# Altium project ControlBoard.PrjPCB (part 2 of 4)

## Sheet CTR_USB.SchDoc: USB
size A4; DrawnBy: Andrei Divinagracia; Revision: 0A; SheetNumber: 9; SheetTotal: 10
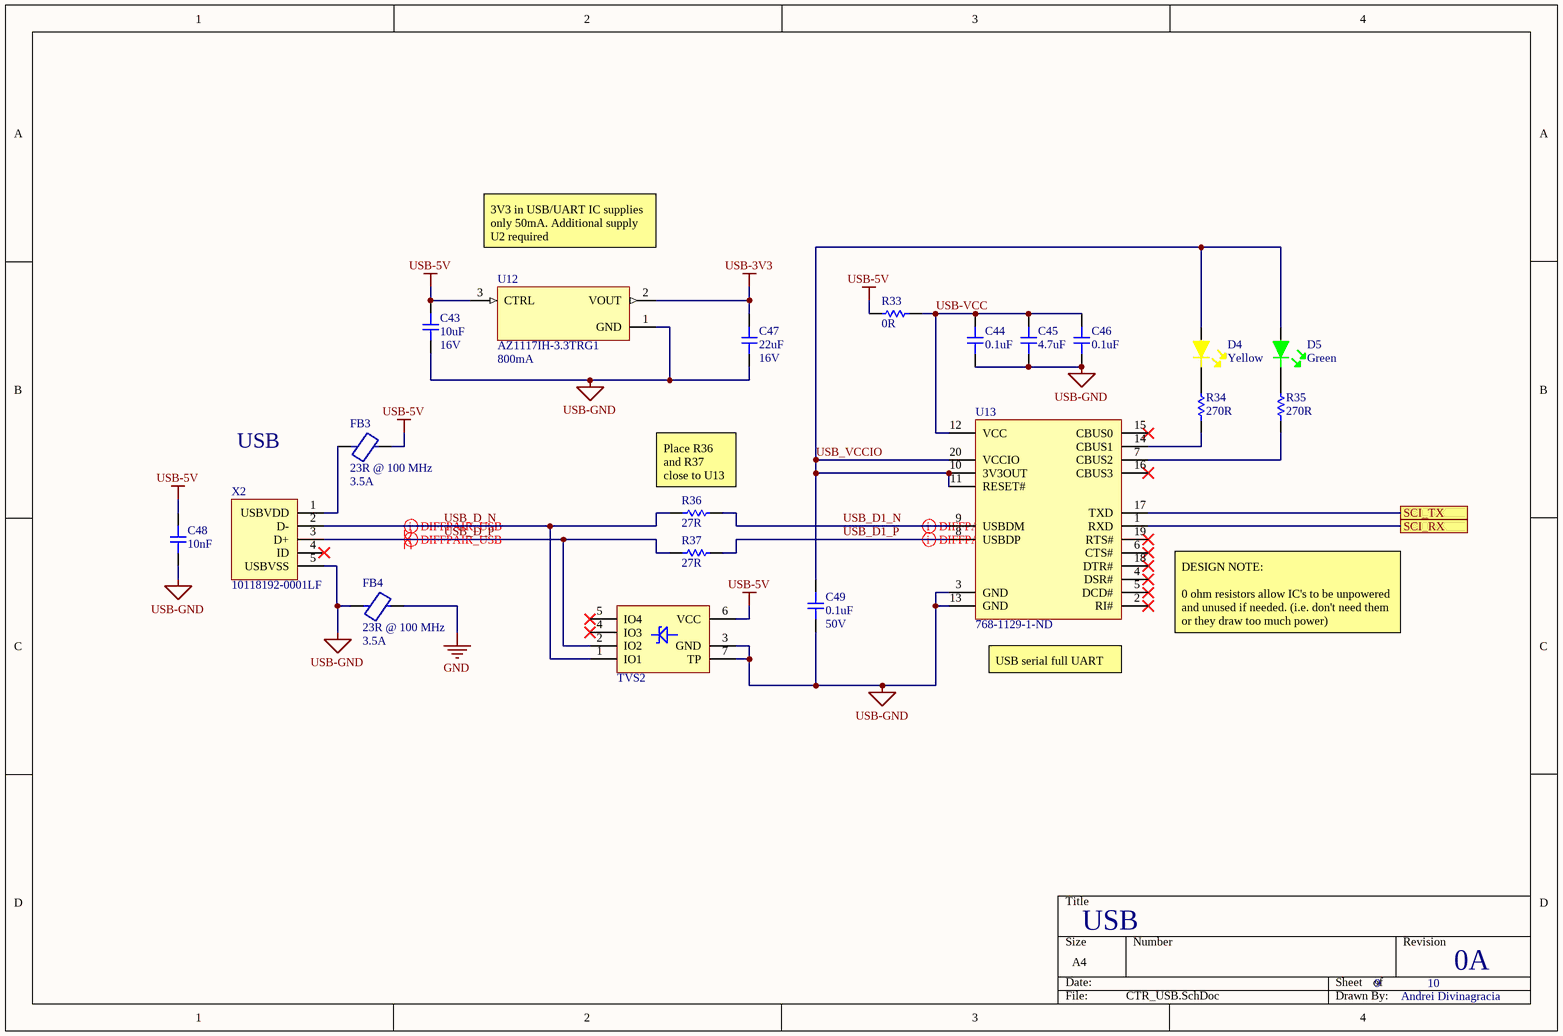
[diagram p4: CTR_USB.SchDoc]

### Parts
C43  10uF  Voltage: 16V  [CAP-0805]
C44  0.1uF  [CAP-0805]
C45  4.7uF  [CAP-1206]
C46  0.1uF  [CAP-0805]
C47  22uF  Voltage Rating: 16V  [CAP-0805]
C48  10nF  [CAP-0805]
C49  0.1uF  Voltage Rating: 50V  [CAP-0603]
D4  Yellow  [LED-0603]
D5  Green  [LED-0603]
FB3  23R @ 100 MHz  Max Current Rating: 3.5A  [FB-1806]
FB4  23R @ 100 MHz  Max Current Rating: 3.5A  [FB-1806]
R33  0R  [RES-0603]
R34  270R  [RES-0603]
R35  270R  [RES-0603]
R36  27R  [RES-0603]
R37  27R  [RES-0603]
TVS2  TVS-4-5.5V-Bi  [TVS-DRS-TP-5]  (value not drawn)
U12  AZ1117IH-3.3TRG1  Output Current: 800mA  [SOT223]
U13  768-1129-1-ND  [SSOP-20]
X2  10118192-0001LF  [USB_MICRO]

### Ports
SCI_RX, SCI_TX

### Nets
GND: FB4.2
USB-3V3: C47.2 U12.2(VOUT)
USB-5V: C43.2 C48.1 FB3.2 R33.2 TVS2.6(VCC) U12.3(CTRL)
USB-GND: C43.1 C44.1 C45.1 C46.1 C47.1 C48.2 C49.1 FB4.1 TVS2.3(GND) TVS2.7(TP) U12.1(GND) U13.3(GND) U13.13(GND) X2.5(USBVSS)
USB-VCC: C44.2 C45.2 C46.2 R33.1 U13.12(VCC)
USB_D1_N: R36.2 U13.9(USBDM)
USB_D1_P: R37.2 U13.8(USBDP)
USB_D_N: R36.1 TVS2.1(IO1) X2.2(D-)
USB_D_P: R37.1 TVS2.2(IO2) X2.3(D+)
USB_VCCIO: C49.2 D4.1 D5.1 U13.10(3V3OUT) U13.11(RESET#) U13.20(VCCIO)
NetD4_2: D4.2 R34.2
NetD5_2: D5.2 R35.2
NetFB3_1: FB3.1 X2.1(USBVDD)
NetR34_1: R34.1 U13.14(CBUS1)
NetR35_1: R35.1 U13.7(CBUS2)
NetU3_1: U13.17(TXD) ; port SCI_TX
NetU3_2: U13.1(RXD) ; port SCI_RX

Not connected (* = marked no-connect by the designer): TVS2 4(IO3)* 5(IO4)*; U13 2(RI#)* 4(DSR#)* 5(DCD#)* 6(CTS#)* 15(CBUS0)* 16(CBUS3)* 18(DTR#)* 19(RTS#)*; X2 4(ID)*

### Layout directives
differential pair: USB_D1_N, USB_D1_P, USB_D_N, USB_D_P

### Notes on the sheet
- (near U12) 3V3 in USB/UART IC supplies only 50mA. Additional supply U2 required
- USB
- (near R36) Place R36 and R37 close to U13
- (near U13) DESIGN NOTE:
  0 ohm resistors allow IC's to be unpowered and unused if needed. (i.e. don't need them or they draw too much power)
- (near U13) USB serial full UART

### Library data of the parts
C43 = 0805-10uF-16V: CAP CER 10UF 16V X5R 0805; Manufacturer: Samsung; Manufacturer Part Number: CL21A106KOQNNNE; Tolerance: 10%; Dielectric: X7R; Supplier 1: Digi-Key; Stock 1: 258396; Pricing 1: 1=0.11, 10=0.084, 50=0.0458, 100=0.0375, 500=0.02676, 1000=0.02103 (USD); Mount: Surface Mount; Case/Package: 0805; Case Code (Metric): 2012; Case Code (Imperial): 0805; Min Operating Temperature: -55°C; Max Operating Temperature: 85°C; Package Quantity: 1; Packaging: Tape and Reel; Series: CL; Voltage Rating: 16V; Capacitance: 10uF; Voltage Rating (DC): 16V; Construction: Flat; Length: 2mm; Width: 0.049inch; Height: 1.25mm; Thickness: 0.055inch; Depth: 1.25mm; Radiation Hardening: No; RoHS Compliant: Yes; Lead Free: Lead Free; ComponentLink1URL: http://www.samsungsem.com/kr/support/product-search/mlcc/CL21A106KOQNNNE.jsp?src-supplier=Digi-Key; ComponentLink1Description: http://www.samsungsem.com/kr/support/product-search/mlcc/CL21A106KOQNNNE.jsp?src-supplier=Digi-Key; ComponentLink2URL: http://www1.futureelectronics.com/doc/SAMSUNG%20PASSIVE/CL05B104KQ5NNNC.pdf?src-supplier=Future+Electronics; ComponentLink2Description: http://www1.futureelectronics.com/doc/SAMSUNG%20PASSIVE/CL05B104KQ5NNNC.pdf?src-supplier=Future+Electronics; ComponentLink3URL: https://www.verical.com/server-webapp/html/getDatasheet?partID=358435&src-supplier=Verical; ComponentLink3Description: https://www.verical.com/server-webapp/html/getDatasheet?partID=358435&src-supplier=Verical; Supplier Part Number 1: 1276-1096-1-ND
C44 C46 = 0805-0.1uF-50V: CAP CER 0.1UF 50V Y5V 0805; Manufacturer: KEMET; Manufacturer Part Number: C0805C104Z5VACTU; Dielectric Material: Ceramic; Tolerance: 80%; Dissipation Factor: 5%; Capacitance: 100nF; Supplier 1: Digi-Key; Stock 1: 929243; Pricing 1: 1=0.1, 10=0.057, 100=0.0254, 500=0.01818, 1000=0.01428 (USD); Mount: Surface Mount,PCB; Case/Package: 0805; Number of Pins: 2; Case Code (Metric): 2012; Case Code (Imperial): 0805; Min Operating Temperature: -30°C; Max Operating Temperature: 85°C; Package Quantity: 1; Voltage Rating: 50V; Packaging: Tape and Reel; Voltage Rating (DC): 50V; Dielectric: Y5V; Termination: SMD/SMT; Voltage: 50V; Length: 2mm; Height: 0.9mm; Lead Pitch: 0.75mm; Width: 0.049inch; Thickness: 0.039inch; Depth: 1.25mm; Radiation Hardening: No; REACH SVHC: No SVHC; Lead Free: Lead Free; ComponentLink1URL: http://www.alliedelec.com/m/d/9bfe7773041ffe9d406e68bc7b377fdd.pdf?src-supplier=Allied+Electronics; ComponentLink1Description: http://www.alliedelec.com/m/d/9bfe7773041ffe9d406e68bc7b377fdd.pdf?src-supplier=Allied+Electronics; ComponentLink2URL: https://www.verical.com/server-webapp/html/getDatasheet?partID=37101&src-supplier=Verical; ComponentLink2Description: https://www.verical.com/server-webapp/html/getDatasheet?partID=37101&src-supplier=Verical; ComponentLink3URL: https://www.verical.com/server-webapp/html/getDatasheet?partID=321176&src-supplier=Verical; ComponentLink3Description: https://www.verical.com/server-webapp/html/getDatasheet?partID=321176&src-supplier=Verical; ComponentLink4URL: http://www.farnell.com/datasheets/2123124.pdf?src-supplier=Element14; ComponentLink4Description: http://www.farnell.com/datasheets/2123124.pdf?src-supplier=Element14; Supplier Part Number 1: 399-1177-6-ND
C45 = 1206-4.7uF-50V: CAP CER 4.7UF 50V X7R 1206; Manufacturer: TDK; Manufacturer Part Number: C3216X7R1H475K160AC; Dielectric Material: Ceramic; Tolerance: 10%; Supplier 1: Digi-Key; Stock 1: 117540; Pricing 1: 1=0.76, 10=0.535, 50=0.4042, 100=0.3521, 500=0.26082, 1000=0.2217 (USD); Mount: Surface Mount; Case/Package: 1206; Case Code (Metric): 3216; Case Code (Imperial): 1206; Weight: 0.000571oz; Min Operating Temperature: -55°C; Max Operating Temperature: 125°C; Capacitance: 4.7uF; Voltage Rating: 50V; Packaging: Tape and Reel; Voltage Rating (DC): 50V; Termination: SMD/SMT; Series: C; Package Quantity: 1; Dielectric: X7R; Resistor Type: Ceramic; Length: 3.2mm; Width: 0.063inch; Depth: 1.6mm; Thickness: 1.6mm; REACH SVHC: No SVHC; Lead Free: Lead Free; RoHS Compliant: Yes; ComponentLink1URL: https://product.tdk.com/info/en/catalog/datasheets/mlcc_commercial_general_en.pdf?src-supplier=Digi-Key; ComponentLink1Description: https://product.tdk.com/info/en/catalog/datasheets/mlcc_commercial_general_en.pdf?src-supplier=Digi-Key; ComponentLink2URL: http://www.mouser.com/ds/2/400/lcc_commercial_general_en-560200.pdf?src-supplier=Mouser; ComponentLink2Description: http://www.mouser.com/ds/2/400/lcc_commercial_general_en-560200.pdf?src-supplier=Mouser; ComponentLink3URL: http://product.tdk.com/capacitor/mlcc/en/documents/mlcc_commercial_general_en.pdf?src-supplier=Future+Electronics; ComponentLink3Description: http://product.tdk.com/capacitor/mlcc/en/documents/mlcc_commercial_general_en.pdf?src-supplier=Future+Electronics; Supplier Part Number 1: 445-8032-6-ND
C47 = 0805-22uF-16V: CAP CER 22UF 16V X5R 0805; Manufacturer: Samsung; Manufacturer Part Number: CL21A226KOQNNNE; Tolerance: 10%; Supplier 1: Digi-Key; Stock 1: 761343; Pricing 1: 1=0.37, 10=0.258, 50=0.1804, 100=0.1546, 500=0.11592, 1000=0.09789 (USD); Mount: Surface Mount; Case/Package: 0805; Case Code (Metric): 2012; Case Code (Imperial): 0805; Min Operating Temperature: -55°C; Max Operating Temperature: 85°C; Packaging: Tape and Reel; Capacitance: 22uF; Voltage Rating (DC): 16V; Length: 0.079inch; Width: 0.049inch; Thickness: 0.055inch; Lead Free: Lead Free; RoHS Compliant: Yes; ComponentLink1URL: http://www.samsungsem.com/kr/support/library/product-catalog/mlcc.jsp?src-supplier=Digi-Key; ComponentLink1Description: http://www.samsungsem.com/kr/support/library/product-catalog/mlcc.jsp?src-supplier=Digi-Key; Supplier Part Number 1: 1276-6526-6-ND
C48 = 0805-10nF-50V: CAP CER SMD 0805 .01UF X7R 5% 50V; Manufacturer: KEMET; Manufacturer Part Number: C0805C103J5RAC7210; Dielectric Material: Ceramic; Supplier 1: Digi-Key; Stock 1: 35151; Pricing 1: 1=0.11, 10=0.078, 100=0.0347, 500=0.0248, 1000=0.01948, 2500=0.01771, 5000=0.01629 (USD); Case/Package: 0805; Case Code (Imperial): 0805; Case Code (Metric): 2012; Min Operating Temperature: -55°C; Max Operating Temperature: 125°C; Tolerance: 5%; Packaging: Tape and Reel; Capacitance: 10nF; Package Quantity: 10000; Voltage Rating: 50V; Voltage Rating (DC): 50V; Dielectric: X7R; Termination: SMD/SMT; Length: 2mm; Lead Pitch: 0.75mm; Depth: 1.25mm; ComponentLink1URL: http://components.arrow.com/part/dataview/3450688S9650973N7429?src-supplier=Arrow; ComponentLink1Description: http://components.arrow.com/part/dataview/3450688S9650973N7429?src-supplier=Arrow; ComponentLink2URL: http://www.mouser.com/ds/2/212/KEM_C1002_X7R_SMD-1102033.pdf?src-supplier=Mouser; ComponentLink2Description: http://www.mouser.com/ds/2/212/KEM_C1002_X7R_SMD-1102033.pdf?src-supplier=Mouser; ComponentLink3URL: https://api.kemet.com/component-edge/download/datasheet/C0805C103J5RAC7210.pdf?src-supplier=Digi-Key; ComponentLink3Description: https://api.kemet.com/component-edge/download/datasheet/C0805C103J5RAC7210.pdf?src-supplier=Digi-Key; Supplier Part Number 1: 399-17616-6-ND
C49 = 0603-0.1uF-50V: CAP CER 0.1UF 50V X7R 0603; Manufacturer: Samsung; Manufacturer Part Number: CL10B104KB8NNNL; Capacitance: 100nF; Tolerance: 10%; Supplier 1: Digi-Key; Stock 1: 1355979; Pricing 1: 1=0.1, 10=0.03, 50=0.0164, 100=0.0134, 500=0.00958, 1000=0.00753, 2500=0.00684, 5000=0.0063 (USD); Mount: Surface Mount; Case/Package: 0603; Min Operating Temperature: -55°C; Max Operating Temperature: 125°C; Packaging: Tape and Reel; Package Quantity: 15000; Dielectric: X7R; Voltage Rating (DC): 50V; Series: CL; Construction: Flat; Length: 1.6mm; Width: 0.031inch; Height: 0.8mm; Thickness: 0.035inch; Depth: 0.8mm; Radiation Hardening: No; RoHS Compliant: Yes; ComponentLink1URL: https://www.verical.com/server-webapp/html/getDatasheet?partID=357523&src-supplier=Verical; ComponentLink1Description: https://www.verical.com/server-webapp/html/getDatasheet?partID=357523&src-supplier=Verical; ComponentLink2URL: https://media.digikey.com/pdf/Data%20Sheets/Samsung%20PDFs/CL_Series_MLCC_ds.pdf?src-supplier=Digi-Key; ComponentLink2Description: https://media.digikey.com/pdf/Data%20Sheets/Samsung%20PDFs/CL_Series_MLCC_ds.pdf?src-supplier=Digi-Key; Supplier Part Number 1: 1276-CL10B104KB8NNNLCT-ND
D4 = LED-YELLOW: LED YELLOW CLEAR 0603 SMD; Manufacturer: Wurth Electronics; Manufacturer Part Number: 150060YS75000; Viewing Angle: 140°; Lens Style: Clear,Rectangular; Wavelength: 590nm; Luminous Intensity: 120mcd; Forward Voltage: 2V; Forward Current: 30mA; Test Current: 20mA; Supplier 1: Digi-Key; Stock 1: 129164; Pricing 1: 1=0.14, 50=0.133, 100=0.114, 500=0.099 (USD); Mount: Surface Mount; Case/Package: 0603; Case Code (Metric): 1608; Case Code (Imperial): 0603; Color: Yellow; Min Operating Temperature: -40°C; Max Operating Temperature: 85°C; Package Quantity: 4000; Packaging: Tape and Reel; Dominant Wavelength: 590nm; Length: 1.6mm; Width: 0.8mm; Height: 0.7mm; REACH SVHC: Unknown; RoHS Compliant: Yes; ComponentLink1URL: http://www.farnell.com/datasheets/1911348.pdf?src-supplier=Element14; ComponentLink1Description: http://www.farnell.com/datasheets/1911348.pdf?src-supplier=Element14; ComponentLink2URL: https://www.distrelec.biz/Web/Downloads/_t/ds/150060YS75000_eng_tds.pdf?mime=application%2Fpdf&src-supplier=Distrelec; ComponentLink2Description: https://www.distrelec.biz/Web/Downloads/_t/ds/150060YS75000_eng_tds.pdf?mime=application%2Fpdf&src-supplier=Distrelec; ComponentLink3URL: https://katalog.we-online.de/led/datasheet/150060YS75000.pdf?src-supplier=Digi-Key; ComponentLink3Description: https://katalog.we-online.de/led/datasheet/150060YS75000.pdf?src-supplier=Digi-Key; ComponentLink4URL: http://katalog.we-online.de/led/datasheet/150060YS75000.pdf?src-supplier=Newark; ComponentLink4Description: http://katalog.we-online.de/led/datasheet/150060YS75000.pdf?src-supplier=Newark; ComponentLink5URL: http://www.produktinfo.conrad.com/datenblaetter/750000-774999/759432-da-01-en-CHIPLED_0603_W_KL_GELB_150060YS75000.pdf?src-supplier=Conrad; ComponentLink5Description: http://www.produktinfo.conrad.com/datenblaetter/750000-774999/759432-da-01-en-CHIPLED_0603_W_KL_GELB_150060YS75000.pdf?src-supplier=Conrad; Supplier Part Number 1: 732-4981-1-ND
D5 = LED-Green: LED GREEN CLEAR 0603 SMD; Manufacturer: Wurth Electronics; Manufacturer Part Number: 150060VS75000; Luminous Intensity: 40mcd; Viewing Angle: 140°; Forward Voltage: 2V; Wavelength: 570nm; Lens Style: Clear,Rectangular; Forward Current: 30mA; Test Current: 20mA; Supplier 1: Digi-Key; Stock 1: 118118; Pricing 1: 1=0.14, 50=0.133, 100=0.114, 500=0.099 (USD); Mount: Surface Mount; Case/Package: 0603; Number of Pins: 2; Color: Green; Case Code (Metric): 1608; Case Code (Imperial): 0603; Min Operating Temperature: -40°C; Max Operating Temperature: 85°C; Package Quantity: 1; Packaging: Tape and Reel; Dominant Wavelength: 570nm; Length: 1.6mm; Height: 0.7mm; Width: 0.8mm; REACH SVHC: Unknown; ComponentLink1URL: https://katalog.we-online.de/led/datasheet/150060VS75000.pdf?src-supplier=Digi-Key; ComponentLink1Description: https://katalog.we-online.de/led/datasheet/150060VS75000.pdf?src-supplier=Digi-Key; Supplier Part Number 1: 732-4980-1-ND
FB3 FB4 = FERR-3A5: FERRITE BEAD 23 OHM 1806 1LN; Manufacturer: Taiyo Yuden; Manufacturer Part Number: FBMJ4516HL230NTV; Resistance: 180623R; Tolerance: 30%; Number of Lines: 1; DC Resistance (DCR): 14mR; Test Frequency: 100MHz; Supplier 1: Digi-Key; Stock 1: 1819; Pricing 1: 1=0.26, 10=0.202, 25=0.1676, 50=0.1444, 100=0.1299, 250=0.1097, 500=0.0982, 1000=0.0837 (USD); Mount: Surface Mount; Case/Package: 1806; Core Material: Ferrite; Case Code (Metric): 4516; Case Code (Imperial): 1806; Min Operating Temperature: -40°C; Max Operating Temperature: 125°C; Impedance: 23R; Package Quantity: 2000; Packaging: Tape and Reel; Max DC Current: 3.5A; Termination: SMD/SMT; Length: 0.177inch; Height: 1.1mm; Width: 1.6mm; Depth: 1.6mm; ComponentLink1URL: http://www.mouser.com/ds/2/396/chipbeads01_e-559265.pdf; ComponentLink1Description: http://www.mouser.com/ds/2/396/chipbeads01_e-559265.pdf; ComponentLink2URL: http://ds.yuden.co.jp/TYCOMPAS/ut/detail.do?productNo=FBMJ4516HL230NTV&fileName=FBMJ4516HL230NTV_SS&mode=specSheetDownload; ComponentLink2Description: http://ds.yuden.co.jp/TYCOMPAS/ut/detail.do?productNo=FBMJ4516HL230NTV&fileName=FBMJ4516HL230NTV_SS&mode=specSheetDownload; ComponentLink3URL: https://www.yuden.co.jp/ut/product/category/emisuppression/FBMJ4516HL230NTV_SS.pdf; ComponentLink3Description: https://www.yuden.co.jp/ut/product/category/emisuppression/FBMJ4516HL230NTV_SS.pdf; Supplier Part Number 1: 587-3857-1-ND
R33 = 0603-0R: RES SMD 0 OHM JUMPER 1/10W 0603; Manufacturer: Yageo; Manufacturer Part Number: RC0603JR-070RL; Resistance: 0mR; Tolerance: 1%; Voltage Rating: 50V; Power Rating: 100mW; Temperature Coefficient: 200ppm/°C; Supplier 1: Digi-Key; Stock 1: 25658294; Pricing 1: 1=0.1, 10=0.019, 25=0.0136, 50=0.0104, 100=0.0077, 250=0.00588, 500=0.00472, 1000=0.00347 (USD); Case/Package: 0603; Number of Pins: 2; Case Code (Imperial): 0603; Case Code (Metric): 1608; Contact Plating: Tin,Matte; Min Operating Temperature: -55°C; Max Operating Temperature: 155°C; Package Quantity: 5000; Packaging: Tape and Reel; Voltage Rating (DC): 50V; Termination: SMD/SMT; Composition: Thick Film; Military Standard: Not; Length: 1.6mm; Height: 0.45mm; Width: 0.8mm; Depth: 0.8mm; Radiation Hardening: No; REACH SVHC: No SVHC; Lead Free: Lead Free; ComponentLink1URL: http://www.farnell.com/datasheets/2167052.pdf?src-supplier=Element14; ComponentLink1Description: http://www.farnell.com/datasheets/2167052.pdf?src-supplier=Element14; ComponentLink2URL: https://www.verical.com/server-webapp/html/getDatasheet?partID=329462&src-supplier=Verical; ComponentLink2Description: https://www.verical.com/server-webapp/html/getDatasheet?partID=329462&src-supplier=Verical; ComponentLink3URL: http://www.yageo.com/documents/recent/PYu-RC_Group_51_RoHS_L_9.pdf?src-supplier=Mouser; ComponentLink3Description: http://www.yageo.com/documents/recent/PYu-RC_Group_51_RoHS_L_9.pdf?src-supplier=Mouser; ComponentLink4URL: http://www.farnell.com/datasheets/443971.pdf?src-supplier=Element14; ComponentLink4Description: http://www.farnell.com/datasheets/443971.pdf?src-supplier=Element14; ComponentLink5URL: http://documents.rs-components.com/techlib://itc_doclist_GB.htm?stockno=6515918&src-supplier=RSComponents; ComponentLink5Description: http://documents.rs-components.com/techlib://itc_doclist_GB.htm?stockno=6515918&src-supplier=RSComponents; Supplier Part Number 1: 311-0.0GRCT-ND
R34 R35 = 0603-270R: RES SMD 270 OHM 0.5% 1/10W 0603; Manufacturer: Yageo; Manufacturer Part Number: RT0603DRE07270RL; Voltage Rating: 75V; Power Rating: 100mW; Temperature Coefficient: 50ppm/°C; Voltage Rating (DC): 50V; Supplier 1: Digi-Key; Stock 1: 5811; Pricing 1: 1=0.1, 10=0.092, 100=0.0352, 1000=0.01549, 2500=0.01338 (USD); Case/Package: 0603; Case Code (Metric): 1608; Case Code (Imperial): 0603; Min Operating Temperature: -55°C; Max Operating Temperature: 155°C; Resistance: 270R; Tolerance: 0.5%; Packaging: Tape and Reel; Package Quantity: 5000; Termination: SMD/SMT; Resistor Type: Thin Film; Number of Terminations: 2; Max Power Dissipation: 100mW; Features: Moisture Resistant; Series: RT; Length: 0.063inch; Width: 0.031inch; Height: 0.022inch; Lead Free: Lead Free; RoHS Compliant: Yes; ComponentLink1URL: http://www.yageo.com/NewPortal/yageodocoutput?fileName=/pdf/R-Chip/PYu-RT_1-to-0.05_RoHS_L_5.pdf&src-supplier=Digi-Key; ComponentLink1Description: http://www.yageo.com/NewPortal/yageodocoutput?fileName=/pdf/R-Chip/PYu-RT_1-to-0.05_RoHS_L_5.pdf&src-supplier=Digi-Key; Supplier Part Number 1: 311-2504-1-ND
R36 R37 = 0603-27R: RES SMD 27 OHM 5% 1/10W 0603; Manufacturer: Panasonic; Manufacturer Part Number: ERJ-3GEYJ270V; Power Rating: 100mW; Voltage Rating: 75V; Temperature Coefficient: 200ppm/°C; Voltage Rating (DC): 50V; Supplier 1: Digi-Key; Stock 1: 20003; Pricing 1: 1=0.1, 10=0.037, 100=0.0151, 1000=0.0068, 2500=0.0059 (USD); Mount: Surface Mount; Case/Package: 0603; Case Code (Metric): 1608; Case Code (Imperial): 0603; Contact Plating: Tin; Weight: 7.1E-05oz; Min Operating Temperature: -55°C; Max Operating Temperature: 155°C; Resistance: 27R; Tolerance: 5%; Packaging: Tape and Reel; Package Quantity: 5000; Resistor Type: Thick Film; Number of Terminations: 2; Termination: SMD/SMT; Max Power Dissipation: 100mW; Features: Automotive AEC-Q200; Series: ERJ; Resistance Tolerance: 5%; Construction: Rectangular; Technology: THICK FILM; Length: 1.6mm; Width: 0.031inch; Height: 0.45mm; Depth: 0.8mm; Radiation Hardening: No; REACH SVHC: No SVHC; Military Standard: Not; Lead Free: Lead Free; RoHS Compliant: Yes; ComponentLink1URL: http://www.jameco.com/Jameco/Products/ProdDS/1988663.pdf?src-supplier=Jameco; ComponentLink1Description: http://www.jameco.com/Jameco/Products/ProdDS/1988663.pdf?src-supplier=Jameco; ComponentLink2URL: http://www.farnell.com/datasheets/1500035.pdf?src-supplier=Element14; ComponentLink2Description: http://www.farnell.com/datasheets/1500035.pdf?src-supplier=Element14; ComponentLink3URL: http://www.farnell.com/datasheets/1678796.pdf?src-supplier=Element14; ComponentLink3Description: http://www.farnell.com/datasheets/1678796.pdf?src-supplier=Element14; ComponentLink4URL: https://www.alliedelec.com/m/d/51cd0790071e1666bdb9d00c57fcf960.pdf?src-supplier=Allied+Electronics; ComponentLink4Description: https://www.alliedelec.com/m/d/51cd0790071e1666bdb9d00c57fcf960.pdf?src-supplier=Allied+Electronics; ComponentLink5URL: http://industrial.panasonic.com/www-data/pdf/AOA0000/AOA0000CE1.pdf?src-supplier=Avnet; ComponentLink5Description: http://industrial.panasonic.com/www-data/pdf/AOA0000/AOA0000CE1.pdf?src-supplier=Avnet; Supplier Part Number 1: P27GCT-ND
TVS2 = TVS-4-5.5V-Bi: TVS DIODE 5.5V 6SON; Manufacturer: Texas Instruments; Manufacturer Part Number: TPD4E001DRSR; Direction: Unidirectional; Capacitance: 1.5pF; Number of Channels: 4; Min Breakdown Voltage: 11V; Peak Pulse Power: 100W; Power Line Protection: Yes; Clamping Voltage: 105.5V; Leakage Current: 1nA; Test Current: 10mA; Peak Pulse Current: 5.5A; Interface: LVDS,USB,Ethernet; Supplier 1: Digi-Key; Stock 1: 16747; Pricing 1: 1=0.67, 10=0.576, 100=0.4304, 500=0.33814 (USD); Number of Pins: 6; Min Operating Temperature: -40°C; Max Operating Temperature: 85°C; Packaging: Tape and Reel; Package Quantity: 1000; Operating Supply Voltage: 5.5V; Number of Bidirectional Channels: 4; Reverse Standoff Voltage: 5.5V; Termination: SMD/SMT; Working Voltage: 5.5V; Max Power Dissipation: 100W; ESD Protection: Yes; Max Reverse Leakage Current: 1nA; Length: 3mm; Width: 3.15mm; Height: 0.75mm; Depth: 3mm; Radiation Hardening: No; REACH SVHC: No SVHC; Lead Free: Lead Free; ComponentLink1URL: http://www.ti.com/lit/ds/symlink/tpd4e001.pdf?src-supplier=Digi-Key; ComponentLink1Description: http://www.ti.com/lit/ds/symlink/tpd4e001.pdf?src-supplier=Digi-Key; ComponentLink2URL: https://www.verical.com/server-webapp/html/getDatasheet?partID=143410&src-supplier=Verical; ComponentLink2Description: https://www.verical.com/server-webapp/html/getDatasheet?partID=143410&src-supplier=Verical; ComponentLink3URL: http://focus.ti.com/lit/ds/symlink/tpd4e001.pdf?src-supplier=Avnet+Europe; ComponentLink3Description: http://focus.ti.com/lit/ds/symlink/tpd4e001.pdf?src-supplier=Avnet+Europe; Supplier Part Number 1: 296-22852-1-ND
U12 = AZ1117IH-3.3TRG1: IC REG LINEAR 3.3V 1A SOT223; Manufacturer: Diodes; Dropout Voltage: 1.2V; Number of Regulators: 1; Supplier 1: Digi-Key; Stock 1: 96644; Pricing 1: 1=0.38, 10=0.305, 25=0.2796, 100=0.2079, 250=0.18844, 500=0.15594, 1000=0.11696 (USD); Mount: Surface Mount; Case/Package: TO-261-4; Number of Pins: 3; Min Operating Temperature: -40°C; Max Operating Temperature: 125°C; Packaging: Tape and Reel; Output Voltage: 3.3V; Min Current Limit: 1A; RoHS Compliant: Yes; ComponentLink1URL: https://www.diodes.com/assets/Datasheets/AZ1117I.pdf?src-supplier=Digi-Key; ComponentLink1Description: https://www.diodes.com/assets/Datasheets/AZ1117I.pdf?src-supplier=Digi-Key; Supplier Part Number 1: AZ1117IH-3.3TRG1DICT-ND; Manufacturer Part Number: AZ1117IH-3.3TRG1
U13 = FT231XS-R: IC USB SERIAL FULL UART 20SSOP; Manufacturer: FTDI; Number of Channels: 1; Max Supply Voltage: 5.5V; Min Supply Voltage: 2.97V; Operating Supply Voltage: 5V; Data Rate: 12Mbps; Interface: UART,USB; Operating Supply Current: 8mA; Supplier 1: Digi-Key; Manufacturer Part Number: FT231XS-R; Stock 1: 54093; Pricing 1: 1=2.22, 25=2.15, 100=2.08, 250=1.88, 500=1.7, 1000=1.675 (USD); Mount: Surface Mount; Case/Package: SSOP; Number of Pins: 20; Weight: 0.016oz; Min Operating Temperature: -40°C; Max Operating Temperature: 85°C; Packaging: Tape and Reel; Package Quantity: 2000; Series: USBmadeEZ-UART, FT-X, X-Chip; Length: 8.74mm; Width: 0.157inch; Height: 0.059inch; Radiation Hardening: No; RoHS Compliant: Yes; ComponentLink1URL: http://www.alliedelec.com/images/products/datasheets/bm/FTDI/70403932.pdf?src-supplier=Allied+Electronics; ComponentLink1Description: http://www.alliedelec.com/images/products/datasheets/bm/FTDI/70403932.pdf?src-supplier=Allied+Electronics; ComponentLink2URL: http://uk.rs-online.com/webdocs/1102/0900766b811020d3.pdf?src-supplier=RSComponents; ComponentLink2Description: http://uk.rs-online.com/webdocs/1102/0900766b811020d3.pdf?src-supplier=RSComponents; ComponentLink3URL: https://media.digikey.com/pdf/Data%20Sheets/FTDI%20Chip%20PDFs/X-Chip_Series_Errata.pdf?src-supplier=Digi-Key; ComponentLink3Description: https://media.digikey.com/pdf/Data%20Sheets/FTDI%20Chip%20PDFs/X-Chip_Series_Errata.pdf?src-supplier=Digi-Key; ComponentLink4URL: http://www.ftdichip.com/Support/Documents/DataSheets/ICs/DS_FT231X.pdf?src-supplier=Digi-Key; ComponentLink4Description: http://www.ftdichip.com/Support/Documents/DataSheets/ICs/DS_FT231X.pdf?src-supplier=Digi-Key; Supplier Part Number 1: 768-1129-1-ND
X2 = CONN-USB: CONN_USB - micro B USB 2.0 Receptacle Connector 5 Position Surface Mount, Right Angle, Horizontal; Manufacturer: Amphenol FCI; Current Rating: 1.8A; Connector Type: USB,Receptacle; Number of Contacts: 5; Insulation Resistance: 1GR; Number of Ports: 1; Max Voltage Rating (AC): 100V; USB Standard: USB 2.0; Pitch: 0.65mm; Supplier 1: Digi-Key; Manufacturer Part Number: 10118192-0001LF; Stock 1: 197826; Pricing 1: 1=0.46, 10=0.437, 25=0.3744, 50=0.318, 100=0.3056, 250=0.2744, 500=0.262 (USD); Mount: Surface Mount,Horizontal; Contact Material: Copper Alloy; Contact Plating: Nickel,Gold; Number of Terminals: 5; Housing Material: Polymer; Colour: Black; Min Operating Temperature: -55°C; Max Operating Temperature: 85°C; Packaging: Tape and Reel; Package Quantity: 1400; Gender: Receptacle; Termination: Solder; Voltage Rating: 100V; Orientation: Right Angle; Length: 7.86mm; Depth: 5.57mm; Radiation Hardening: No; REACH SVHC: No SVHC; Lead Free: Lead Free; Flammability Rating: UL94 V-0; ComponentLink1URL: https://datasheet.ciiva.com/26853/getdatasheetpartid-418041-26853891.pdf; ComponentLink1Description: https://datasheet.ciiva.com/26853/getdatasheetpartid-418041-26853891.pdf; ComponentLink2URL: https://datasheet.ciiva.com/851/10118192-851112.pdf; ComponentLink2Description: https://datasheet.ciiva.com/851/10118192-851112.pdf; ComponentLink3URL: https://datasheet.ciiva.com/4598/10118192ac-197249-4598796.pdf; ComponentLink3Description: https://datasheet.ciiva.com/4598/10118192ac-197249-4598796.pdf; Supplier Part Number 1: 609-4613-1-ND

## Sheet CTR_MCU_Circuits.SchDoc: TMS320 Circuits
size A4; DrawnBy: Andrei Divinagracia; Revision: 0A; SheetNumber: 6; SheetTotal: 10
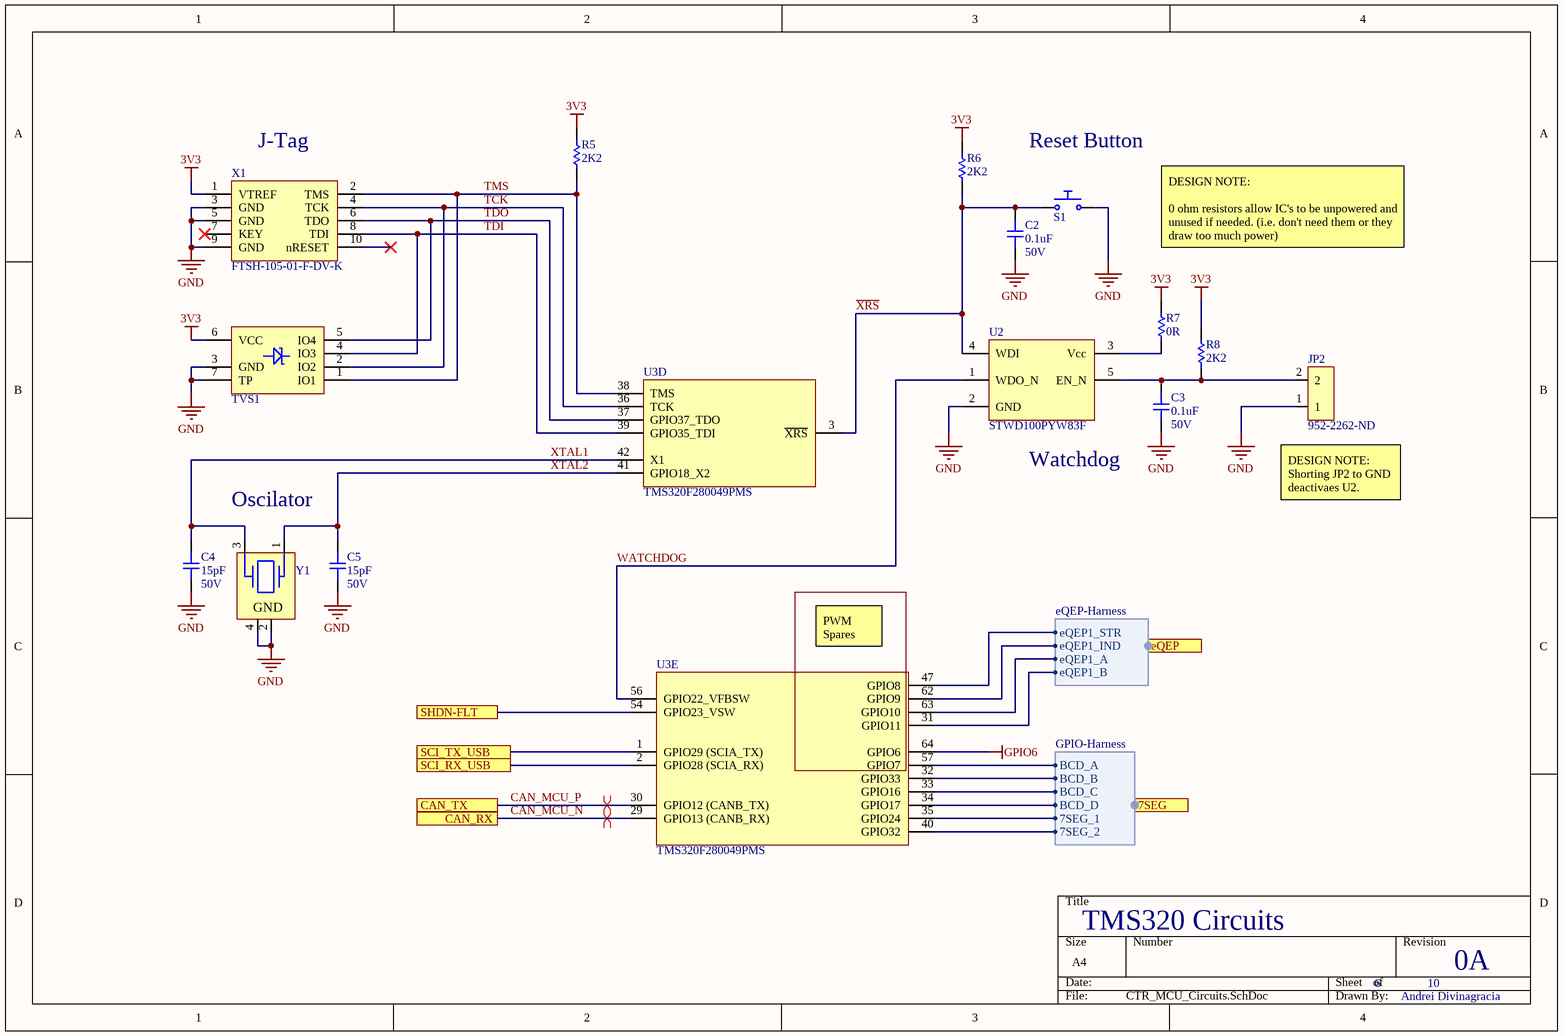
[diagram p5: CTR_MCU_Circuits.SchDoc]

### Parts
C2  0.1uF  Voltage Rating: 50V  [CAP-0805]
C3  0.1uF  Voltage Rating: 50V  [CAP-0805]
C4  15pF  Voltage Rating: 50V  [CAP-0603]
C5  15pF  Voltage Rating: 50V  [CAP-0603]
JP2  952-2262-ND  [2PIN_HEADER]
R5  2K2  [RES-0603]
R6  2K2  [RES-0603]
R7  0R  [RES-0603]
R8  2K2  [RES-0603]
S1  PTS645SM43SMTR92LFS  [PUSH_BUTTON]  (value not drawn)
TVS1  TVS-4-5.5V-Bi  [TVS-DRS-TP-5]  (value not drawn)
U2  STWD100PYW83F  [SOT23-5-WATCHDOG]
U3  TMS320F280049PMS  [64QFP]  (parts D,E of 5)
X1  FTSH-105-01-F-DV-K  [JTAG_50mil_10pin]
Y1  ECS-200-18-30B-AGN-TR  [XTAL-SMD-4]  (value not drawn)

### Ports
7SEG (harness GPIO-Harness), CAN_RX, CAN_TX, eQEP (harness eQEP-Harness), SCI_RX_USB, SCI_TX_USB, SHDN-FLT

### Harnesses
eQEP-Harness: eQEP1_A, eQEP1_B, eQEP1_IND, eQEP1_STR
GPIO-Harness: 7SEG_2, 7SEG_1, BCD_C, BCD_B, BCD_A, BCD_D

### Nets
3V3: R5.1 R6.1 R7.2 R8.2 TVS1.6(VCC) X1.1(VTREF)
GND: C2.1 C3.1 C4.1 C5.1 JP2.1 S1.2 TVS1.3(GND) TVS1.7(TP) U2.2(GND) X1.3(GND) X1.5(GND) X1.9(GND) Y1.2(GND) Y1.4(GND)
GPIO6: U3.64(GPIO6)
7SEG_1: U3.35(GPIO24) ; port 7SEG.7SEG_1
7SEG_2: U3.40(GPIO32) ; port 7SEG.7SEG_2
A_CLK: U3.62(GPIO9) ; port eQEP.eQEP1_IND
A_SIMO: U3.47(GPIO8) ; port eQEP.eQEP1_STR
A_SOMI: U3.63(GPIO10) ; port eQEP.eQEP1_A
A_STE: U3.31(GPIO11) ; port eQEP.eQEP1_B
BCD_A: U3.57(GPIO7) ; port 7SEG.BCD_A
BCD_B: U3.32(GPIO33) ; port 7SEG.BCD_B
BCD_C: U3.33(GPIO16) ; port 7SEG.BCD_C
BCD_D: U3.34(GPIO17) ; port 7SEG.BCD_D
CAN_MCU_N: U3.29(GPIO13_(CANB_RX)) ; port CAN_RX
CAN_MCU_P: U3.30(GPIO12_(CANB_TX)) ; port CAN_TX
TCK: TVS1.2(IO2) U3.36(TCK) X1.4(TCK)
TDI: TVS1.4(IO3) U3.39(GPIO35_TDI) X1.8(TDI)
TDO: TVS1.5(IO4) U3.37(GPIO37_TDO) X1.6(TDO)
TMS: R5.2 TVS1.1(IO1) U3.38(TMS) X1.2(TMS)
WATCHDOG: U2.1(WDO_N) U3.56(GPIO22_VFBSW)
~{XRS}: C2.2 R6.2 S1.1 U2.4(WDI) U3.3(~{XRS})
XTAL1: C4.2 U3.42(X1) Y1.3(OUT)
XTAL2: C5.2 U3.41(GPIO18_X2) Y1.1(IN)
NetC3_2: C3.2 JP2.2 R8.1 U2.5(EN_N)
NetJ2_9: U3.54(GPIO23_VSW) ; port SHDN-FLT
NetR7_1: R7.1 U2.3(Vcc)
NetU3_1: U3.1(GPIO29_(SCIA_TX)) ; port SCI_TX_USB
NetU3_2: U3.2(GPIO28_(SCIA_RX)) ; port SCI_RX_USB

Not connected (* = marked no-connect by the designer): X1 7(KEY)* 10(nRESET)*

### Layout directives
differential pair: CAN_MCU_N, CAN_MCU_P

### Notes on the sheet
- (near X1) J-Tag
- Reset Button
- DESIGN NOTE:
  0 ohm resistors allow IC's to be unpowered and unused if needed. (i.e. don't need them or they draw too much power)
- Oscilator
- Watchdog
- (near JP2) DESIGN NOTE:
  Shorting JP2 to GND deactivaes U2.
- (near U3) PWM Spares

### Library data of the parts
C2 C3 = 0805-0.1uF-50V: as C44 on sheet CTR_USB; Supplier 1: Digi-Key; Stock 1: 929243; Pricing 1: 1=0.1, 10=0.057, 100=0.0254, 500=0.01818, 1000=0.01428 (USD); Mount: Surface Mount,PCB; Case/Package: 0805; Number of Pins: 2; Case Code (Metric): 2012; Case Code (Imperial): 0805; Min Operating Temperature: -30°C; Max Operating Temperature: 85°C; Package Quantity: 1; Packaging: Tape and Reel; Voltage Rating (DC): 50V; Dielectric: Y5V; Termination: SMD/SMT; Voltage: 50V; Length: 2mm; Height: 0.9mm; Lead Pitch: 0.75mm; Width: 0.049inch; Thickness: 0.039inch; Depth: 1.25mm; Radiation Hardening: No; REACH SVHC: No SVHC; Lead Free: Lead Free; ComponentLink1URL: http://www.alliedelec.com/m/d/9bfe7773041ffe9d406e68bc7b377fdd.pdf?src-supplier=Allied+Electronics; ComponentLink1Description: http://www.alliedelec.com/m/d/9bfe7773041ffe9d406e68bc7b377fdd.pdf?src-supplier=Allied+Electronics; ComponentLink2URL: https://www.verical.com/server-webapp/html/getDatasheet?partID=37101&src-supplier=Verical; ComponentLink2Description: https://www.verical.com/server-webapp/html/getDatasheet?partID=37101&src-supplier=Verical; ComponentLink3URL: https://www.verical.com/server-webapp/html/getDatasheet?partID=321176&src-supplier=Verical; ComponentLink3Description: https://www.verical.com/server-webapp/html/getDatasheet?partID=321176&src-supplier=Verical; ComponentLink4URL: http://www.farnell.com/datasheets/2123124.pdf?src-supplier=Element14; ComponentLink4Description: http://www.farnell.com/datasheets/2123124.pdf?src-supplier=Element14; Supplier Part Number 1: 399-1177-6-ND
C4 C5 = 0603-15pF: CAP CER 15PF 50V C0G/NPO 0603; Manufacturer: Yageo; Manufacturer Part Number: CC0603JRNPO9BN150; Dielectric Material: Ceramic; Tolerance: 5%; Dielectric: C0G; Insulation Resistance: 100GR; Supplier 1: Digi-Key; Stock 1: 209662; Pricing 1: 1=0.1, 10=0.046, 50=0.025, 100=0.0203, 500=0.01454, 1000=0.01142 (USD); Mount: Surface Mount; Case/Package: 0603; Number of Pins: 2; Case Code (Metric): 1608; Case Code (Imperial): 0603; Min Operating Temperature: -55°C; Max Operating Temperature: 125°C; Capacitance: 15pF; Packaging: Tape and Reel; Package Quantity: 1; Termination: SMD/SMT; Series: CC; Length: 1.6mm; Width: 0.031inch; Height: 0.8mm; Thickness: 0.035inch; Depth: 0.8mm; Radiation Hardening: No; REACH SVHC: No SVHC; Lead Free: Lead Free; RoHS Compliant: Yes; ComponentLink1URL: http://www.farnell.com/datasheets/1443161.pdf?src-supplier=Element14; ComponentLink1Description: http://www.farnell.com/datasheets/1443161.pdf?src-supplier=Element14; ComponentLink2URL: http://www.yageo.com/documents/recent/UPY-GP_NP0_16V-to-50V_16.pdf?src-supplier=Digi-Key; ComponentLink2Description: http://www.yageo.com/documents/recent/UPY-GP_NP0_16V-to-50V_16.pdf?src-supplier=Digi-Key; ComponentLink3URL: http://www.farnell.com/datasheets/2213336.pdf?src-supplier=Element14; ComponentLink3Description: http://www.farnell.com/datasheets/2213336.pdf?src-supplier=Element14; ComponentLink4URL: http://www.yageo.com/documents/recent/UPY-GP_NP0_16V-to-50V_8.pdf?src-supplier=Avnet; ComponentLink4Description: http://www.yageo.com/documents/recent/UPY-GP_NP0_16V-to-50V_8.pdf?src-supplier=Avnet; ComponentLink5URL: http://www.yageo.com/documents/recent/UPY-GP_NP0_16V-to-50V_8.pdf?src-supplier=Avnet+Europe; ComponentLink5Description: http://www.yageo.com/documents/recent/UPY-GP_NP0_16V-to-50V_8.pdf?src-supplier=Avnet+Europe; Supplier Part Number 1: 311-1060-1-ND
JP2 = M20-9990246: CONN HEADER VERT 2POS 2.54MM; Manufacturer: Harwin; Contact Resistance: 30mR; Max Current Rating: 3A; Number of Positions: 2; Gender: Male; Connector Type: Male Pin; Insulation Resistance: 10GR; Voltage Rating (AC): 750V; Supplier 1: Digi-Key; Manufacturer Part Number: M20-9990246; Stock 1: 53577; Pricing 1: 1=0.11, 10=0.099, 100=0.0609, 500=0.0504, 1000=0.0441, 5000=0.0378, 10000=0.0368 (USD); Case/Package: SIL; Colour: Black; Housing Colour: Black; Housing Material: Nylon; Contact Plating: Tin; Contact Material: Bronze,Brass; Min Operating Temperature: -40°C; Max Operating Temperature: 105°C; Package Quantity: 1000; Packaging: Bulk; Termination: Solder; Number of Rows: 1; Number of Contacts: 2; Orientation: Straight; Current Rating: 3A; Length: 5.08mm; Depth: 2.54mm; Pitch: 2.54mm; Contact Mating Length: 0.24inch; Radiation Hardening: No; REACH SVHC: No SVHC; ComponentLink1URL: https://datasheet.ciiva.com/8046/315376-8046930.pdf; ComponentLink1Description: https://datasheet.ciiva.com/8046/315376-8046930.pdf; ComponentLink2URL: https://datasheet.ciiva.com/6833/m20-999-6833368.pdf; ComponentLink2Description: https://datasheet.ciiva.com/6833/m20-999-6833368.pdf; ComponentLink3URL: https://datasheet.ciiva.com/11745/0900766b81034e61-11745755.pdf; ComponentLink3Description: https://datasheet.ciiva.com/11745/0900766b81034e61-11745755.pdf; ComponentLink4URL: https://datasheet.ciiva.com/22660/1830818-22660571.pdf; ComponentLink4Description: https://datasheet.ciiva.com/22660/1830818-22660571.pdf; ComponentLink5URL: https://datasheet.ciiva.com/26852/getdatasheetpartid-384170-26852203.pdf; ComponentLink5Description: https://datasheet.ciiva.com/26852/getdatasheetpartid-384170-26852203.pdf; Supplier Part Number 1: 952-2262-ND
R5 R6 R8 = 0603-2K2: RES SMD 2.2K OHM 5% 1/10W 0603; Manufacturer: Yageo; Manufacturer Part Number: AC0603JR-072K2L; Resistance: 2.2kR; Power Rating: 100mW; Voltage Rating: 50V; Temperature Coefficient: 100ppm/°C; Supplier 1: Digi-Key; Stock 1: 107229; Pricing 1: 1=0.1, 10=0.024, 100=0.0097, 1000=0.00436, 2500=0.00378 (USD); Case/Package: 0603; Case Code (Imperial): 0603; Case Code (Metric): 1608; Contact Plating: Tin,Matte; Min Operating Temperature: -55°C; Max Operating Temperature: 155°C; Tolerance: 5%; Packaging: Tape and Reel; Resistor Type: Thick Film; Termination: SMD/SMT; Number of Terminations: 2; Max Power Dissipation: 100mW; Features: Moisture Resistant,Automotive AEC-Q200; Series: AC; Length: 0.063inch; Width: 0.8mm; Height: 0.022inch; Radiation Hardening: No; Lead Free: Lead Free; RoHS Compliant: Yes; ComponentLink1URL: http://www.mouser.com/ds/2/447/yageodocoutput-1111992.pdf?src-supplier=Mouser; ComponentLink1Description: http://www.mouser.com/ds/2/447/yageodocoutput-1111992.pdf?src-supplier=Mouser; ComponentLink2URL: http://www.yageo.com/documents/recent/PYu-AC_51_RoHS_L_2_revised.pdf?src-supplier=Avnet+Europe; ComponentLink2Description: http://www.yageo.com/documents/recent/PYu-AC_51_RoHS_L_2_revised.pdf?src-supplier=Avnet+Europe; ComponentLink3URL: http://www.yageo.com/NewPortal/yageodocoutput?fileName=/pdf/R-Chip/PYu-AC_51_RoHS_L_6.pdf&src-supplier=Digi-Key; ComponentLink3Description: http://www.yageo.com/NewPortal/yageodocoutput?fileName=/pdf/R-Chip/PYu-AC_51_RoHS_L_6.pdf&src-supplier=Digi-Key; ComponentLink4URL: https://www.yageo.com/upload/media/product/productsearch/datasheet/rchip/PYu-AC_51_RoHS_L_7.pdf?src-supplier=Digi-Key; ComponentLink4Description: https://www.yageo.com/upload/media/product/productsearch/datasheet/rchip/PYu-AC_51_RoHS_L_7.pdf?src-supplier=Digi-Key; Supplier Part Number 1: YAG3657CT-ND
R7 = 0603-0R: as R33 on sheet CTR_USB; Supplier 1: Digi-Key; Stock 1: 25658294; Pricing 1: 1=0.1, 10=0.019, 25=0.0136, 50=0.0104, 100=0.0077, 250=0.00588, 500=0.00472, 1000=0.00347 (USD); Case/Package: 0603; Number of Pins: 2; Case Code (Imperial): 0603; Case Code (Metric): 1608; Contact Plating: Tin,Matte; Min Operating Temperature: -55°C; Max Operating Temperature: 155°C; Package Quantity: 5000; Packaging: Tape and Reel; Voltage Rating (DC): 50V; Termination: SMD/SMT; Composition: Thick Film; Military Standard: Not; Length: 1.6mm; Height: 0.45mm; Width: 0.8mm; Depth: 0.8mm; Radiation Hardening: No; REACH SVHC: No SVHC; Lead Free: Lead Free; ComponentLink1URL: http://www.farnell.com/datasheets/2167052.pdf?src-supplier=Element14; ComponentLink1Description: http://www.farnell.com/datasheets/2167052.pdf?src-supplier=Element14; ComponentLink2URL: https://www.verical.com/server-webapp/html/getDatasheet?partID=329462&src-supplier=Verical; ComponentLink2Description: https://www.verical.com/server-webapp/html/getDatasheet?partID=329462&src-supplier=Verical; ComponentLink3URL: http://www.yageo.com/documents/recent/PYu-RC_Group_51_RoHS_L_9.pdf?src-supplier=Mouser; ComponentLink3Description: http://www.yageo.com/documents/recent/PYu-RC_Group_51_RoHS_L_9.pdf?src-supplier=Mouser; ComponentLink4URL: http://www.farnell.com/datasheets/443971.pdf?src-supplier=Element14; ComponentLink4Description: http://www.farnell.com/datasheets/443971.pdf?src-supplier=Element14; ComponentLink5URL: http://documents.rs-components.com/techlib://itc_doclist_GB.htm?stockno=6515918&src-supplier=RSComponents; ComponentLink5Description: http://documents.rs-components.com/techlib://itc_doclist_GB.htm?stockno=6515918&src-supplier=RSComponents; Supplier Part Number 1: 311-0.0GRCT-ND
S1 = PTS645SM43SMTR92LFS: SWITCH TACTILE SPST-NO 0.05A 12V; Manufacturer: ITT C&K; Mechanical Life: 100000Cycles; Actuator Material: Nylon,Polyamide; Throw Configuration: SPST; Contact Resistance: 100mR; Operating Force: 160gf; Max Current Rating: 50mA; Illumination Type: Non-Illuminated,Illuminated; Switch Function: Off-Mom; Actuator Length: 0.85mm; Supplier 1: Digi-Key; Manufacturer Part Number: PTS645SM43SMTR92LFS; Stock 1: 188827; Pricing 1: 1=0.16, 10=0.157, 25=0.1516, 50=0.1462, 100=0.1381, 250=0.13, 500=0.1245 (USD); Mount: Surface Mount; Case/Package: SMD/SMT; Contact Plating: Silver; Contact Material: Silver; Colour: Black; Min Operating Temperature: -20°C; Max Operating Temperature: 60°C; Max Voltage Rating (DC): 12V; Packaging: Tape and Reel; Package Quantity: 1000; Current Rating: 50mA; Voltage Rating (DC): 12V; Termination: Gull Wing; Orientation: Straight; Length: 6mm; Depth: 9mm; REACH SVHC: No SVHC; Lead Free: Lead Free; ComponentLink1URL: https://datasheet.ciiva.com/29903/getdatasheetpartid-786341-29903846.pdf; ComponentLink1Description: https://datasheet.ciiva.com/29903/getdatasheetpartid-786341-29903846.pdf; ComponentLink2URL: https://datasheet.ciiva.com/14920/pts645-14920733.pdf; ComponentLink2Description: https://datasheet.ciiva.com/14920/pts645-14920733.pdf; ComponentLink3URL: https://datasheet.ciiva.com/14920/pts645-14920734.pdf; ComponentLink3Description: https://datasheet.ciiva.com/14920/pts645-14920734.pdf; ComponentLink4URL: https://datasheet.ciiva.com/14920/pts645-14920735.pdf; ComponentLink4Description: https://datasheet.ciiva.com/14920/pts645-14920735.pdf; ComponentLink5URL: https://datasheet.ciiva.com/29931/getdatasheetpartid-764615-29931183.pdf; ComponentLink5Description: https://datasheet.ciiva.com/29931/getdatasheetpartid-764615-29931183.pdf; Supplier Part Number 1: CKN9112CT-ND
TVS1 = TVS-4-5.5V-Bi: as TVS2 on sheet CTR_USB; Supplier 1: Digi-Key; Stock 1: 16747; Pricing 1: 1=0.67, 10=0.576, 100=0.4304, 500=0.33814 (USD); Number of Pins: 6; Min Operating Temperature: -40°C; Max Operating Temperature: 85°C; Packaging: Tape and Reel; Package Quantity: 1000; Operating Supply Voltage: 5.5V; Number of Bidirectional Channels: 4; Reverse Standoff Voltage: 5.5V; Termination: SMD/SMT; Working Voltage: 5.5V; Max Power Dissipation: 100W; ESD Protection: Yes; Max Reverse Leakage Current: 1nA; Length: 3mm; Width: 3.15mm; Height: 0.75mm; Depth: 3mm; Radiation Hardening: No; REACH SVHC: No SVHC; Lead Free: Lead Free; ComponentLink1URL: http://www.ti.com/lit/ds/symlink/tpd4e001.pdf?src-supplier=Digi-Key; ComponentLink1Description: http://www.ti.com/lit/ds/symlink/tpd4e001.pdf?src-supplier=Digi-Key; ComponentLink2URL: https://www.verical.com/server-webapp/html/getDatasheet?partID=143410&src-supplier=Verical; ComponentLink2Description: https://www.verical.com/server-webapp/html/getDatasheet?partID=143410&src-supplier=Verical; ComponentLink3URL: http://focus.ti.com/lit/ds/symlink/tpd4e001.pdf?src-supplier=Avnet+Europe; ComponentLink3Description: http://focus.ti.com/lit/ds/symlink/tpd4e001.pdf?src-supplier=Avnet+Europe; Supplier Part Number 1: 296-22852-1-ND
U2 = STWD100PYW83F: IC WDT CIRCUIT SOT323-5; Manufacturer: STMicroelectronics; Nominal Supply Current: 13uA; Max Supply Voltage: 5.5V; Max Power Dissipation: 320mW; Min Supply Voltage: 2.7V; Number of Voltages Monitored: 1; Reset: Active Low; Reset Timeout: 1.12s; Output: TOTEM-POLE; Supplier 1: Digi-Key; Manufacturer Part Number: STWD100PYW83F; Stock 1: 10672; Pricing 1: 1=0.87, 10=0.763, 25=0.7164, 100=0.5846, 250=0.543, 500=0.46214, 1000=0.38148 (USD); Mount: Surface Mount; Case/Package: SC; Number of Pins: 5; Weight: 0.000705oz; Min Operating Temperature: -40°C; Max Operating Temperature: 125°C; Package Quantity: 1; Packaging: Tape and Reel; Number of Timers/Counters: 1; Type: Watchdog Circuit; Series: -; Supply Current: 13uA; Length: 2.2mm; Width: 1.35mm; Height: 1mm; REACH SVHC: No SVHC; Lead Free: Lead Free; RoHS Compliant: Yes; ComponentLink1URL: http://www.st.com/content/ccc/resource/sales_and_marketing/promotional_material/flyer/52/2d/7f/6c/74/bb/43/70/flcarefree1213.pdf/files/flcarefree1213.pdf/jcr:content/translations/en.flcarefree1213.pdf?src-supplier=Digi-Key; ComponentLink1Description: http://www.st.com/content/ccc/resource/sales_and_marketing/promotional_material/flyer/52/2d/7f/6c/74/bb/43/70/flcarefree1213.pdf/files/flcarefree1213.pdf/jcr:content/translations/en.flcarefree1213.pdf?src-supplier=Digi-Key; ComponentLink2URL: http://www.st.com/content/ccc/resource/technical/document/datasheet/06/6a/b3/83/9a/c7/4f/22/CD00176077.pdf/files/CD00176077.pdf/jcr:content/translations/en.CD00176077.pdf?src-supplier=Digi-Key; ComponentLink2Description: http://www.st.com/content/ccc/resource/technical/document/datasheet/06/6a/b3/83/9a/c7/4f/22/CD00176077.pdf/files/CD00176077.pdf/jcr:content/translations/en.CD00176077.pdf?src-supplier=Digi-Key; ComponentLink3URL: http://www.st.com/web/en/resource/technical/document/datasheet/CD00176077.pdf?src-supplier=Future+Electronics; ComponentLink3Description: http://www.st.com/web/en/resource/technical/document/datasheet/CD00176077.pdf?src-supplier=Future+Electronics; ComponentLink4URL: http://www.produktinfo.conrad.com/datenblaetter/1100000-1199999/001184854-da-01-en-IC_CIRCU_STWD100PYW83F_SOT_323_5_STM.pdf?src-supplier=Conrad; ComponentLink4Description: http://www.produktinfo.conrad.com/datenblaetter/1100000-1199999/001184854-da-01-en-IC_CIRCU_STWD100PYW83F_SOT_323_5_STM.pdf?src-supplier=Conrad; Supplier Part Number 1: 497-13372-1-ND
U3 = TMS320F280049: IC MCU 32BIT 256KB FLASH 64LQFP; Manufacturer: Texas Instruments; Manufacturer Part Number: F280049CPMS; Number of UART Channels: 2; Interface: I2C,SPI,UART,USART,SCI; Peripherals: Brown-out Detect/Reset,POR,PWM,WDT; Frequency: 100MHz; Number of I/Os: 26; Oscillator Type: Internal; Supplier 1: Mouser; Stock 1: 0; Pricing 1: 1=10.7, 10=9.68, 50=9.23, 100=8.01, 1000=6.07, 10000=6.07 (USD); Case/Package: LQFP; Min Operating Temperature: -40°C; Max Operating Temperature: 125°C; Memory Type: FLASH; Packaging: Tray; Memory Size: 256KB; RoHS Compliant: Yes; ComponentLink1URL: http://www.ti.com/lit/pdf/sprui33?src-supplier=Digi-Key; ComponentLink1Description: http://www.ti.com/lit/pdf/sprui33?src-supplier=Digi-Key; Supplier Part Number 1: 595-F280049CPMS
X1 = CONN-JTAG: CONN_JTAG_10pin .050 Connector Dual Header 10 Position Surface Mount; Manufacturer: Samtec; Max Current Rating: 1.75A; Number of Positions: 10; Connector Type: Male Pin; Pitch: 1.27mm; Row Spacing: 0.05inch; Supplier 1: Digi-Key; Manufacturer Part Number: FTSH-105-01-F-DV-K; Stock 1: 18199; Pricing 1: 1=2.9, 10=2.784, 100=2.32, 500=1.972, 1000=1.682, 5000=1.508 (USD); Mount: Surface Mount; Contact Material: Bronze,Copper; Contact Plating: Nickel,Gold; Colour: Black; Housing Colour: Black; Housing Material: Polymer; Min Operating Temperature: -55°C; Max Operating Temperature: 125°C; Number of Rows: 2; Packaging: Rail/Tube; Package Quantity: 1; Termination: Solder; Number of Contacts: 10; Orientation: Straight; Length: 15.2mm; Height: 3.3mm; Contact Mating Length: 0.12inch; Depth: 3.43mm; Radiation Hardening: No; Lead Free: Lead Free; ComponentLink1URL: https://datasheet.ciiva.com/19461/2046846-19461026.pdf; ComponentLink1Description: https://datasheet.ciiva.com/19461/2046846-19461026.pdf; ComponentLink2URL: https://datasheet.ciiva.com/738/ftsh-1xx-xx-xxx-dv-xxx-mkt-738998.pdf; ComponentLink2Description: https://datasheet.ciiva.com/738/ftsh-1xx-xx-xxx-dv-xxx-mkt-738998.pdf; ComponentLink3URL: https://datasheet.ciiva.com/10245/ftsh-mt-10245273.pdf; ComponentLink3Description: https://datasheet.ciiva.com/10245/ftsh-mt-10245273.pdf; ComponentLink4URL: https://datasheet.ciiva.com/16657/ftsh-mt-16657371.pdf; ComponentLink4Description: https://datasheet.ciiva.com/16657/ftsh-mt-16657371.pdf; ComponentLink5URL: https://datasheet.ciiva.com/15195/getdatasheetpartid-133463-15195260.pdf; ComponentLink5Description: https://datasheet.ciiva.com/15195/getdatasheetpartid-133463-15195260.pdf; Supplier Part Number 1: SAM8796-ND
Y1 = ECS-200-18-30B-AGN-TR: CRYSTAL 20.0000MHZ 18PF SMD; Manufacturer: ECS International; Supplier 1: Digi-Key; Manufacturer Part Number: ECS-200-18-30B-AGN-TR; Stock 1: 2820; Pricing 1: 1=0.69, 10=0.575, 50=0.5176, 100=0.46, 500=0.437 (USD); Supplier Part Number 1: XC2693CT-ND